# EAGLE schematic vco_pots (EAGLE 7.7.0)
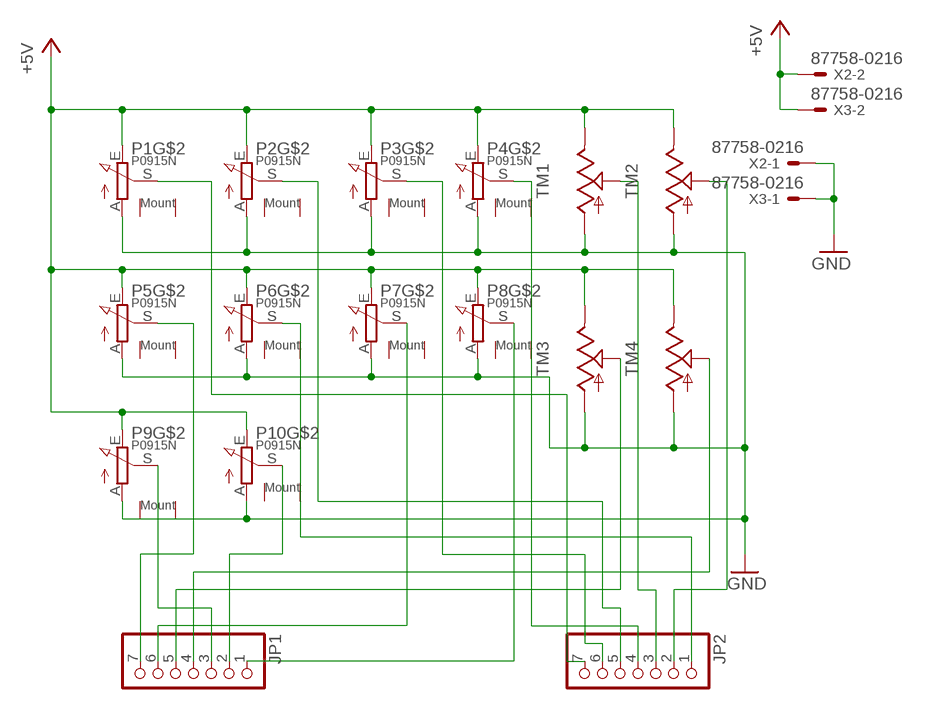
[diagram p0: schematic, sheet 1]

## Parts
JP1  PINHD-1X7  [1X07]
JP2  PINHD-1X7  [1X07]
P1  P0915N  [P0915N]
P2  P0915N  [P0915N]
P3  P0915N  [P0915N]
P4  P0915N  [P0915N]
P5  P0915N  [P0915N]
P6  P0915N  [P0915N]
P7  P0915N  [P0915N]
P8  P0915N  [P0915N]
P9  P0915N  [P0915N]
P10  P0915N  [P0915N]
TM1  TRIMSLIDE60  [SLIDEPOT-60]
TM2  TRIMSLIDE60  [SLIDEPOT-60]
TM3  TRIMSLIDE60  [SLIDEPOT-60]
TM4  TRIMSLIDE60  [SLIDEPOT-60]
X2  87758-0216  [87758-0216]
X3  87758-0216  [87758-0216]

## Nets
+5V: P1.E P2.E P3.E P4.E P5.E P6.E P7.E P8.E P9.E P10.E TM1.B TM2.B TM3.B TM4.B X2.2 X3.2
GND: P1.A P2.A P3.A P4.A P5.A P6.A P7.A P8.A P9.A P10.A TM1.A TM2.A TM3.A TM4.A X2.1 X3.1
N$1: JP1.2 P10.S
N$2: JP2.1 P6.S
N$3: JP2.5 P2.S
N$4: JP1.6 P7.S
N$5: JP2.6 P3.S
N$6: JP1.1 P8.S
N$7: JP1.3 P9.S
N$8: JP1.7 P5.S
N$9: JP2.7 P1.S
N$10: JP2.4 P4.S
N$11: JP1.4 TM4.WIPER
N$12: JP1.5 TM3.WIPER
N$13: JP2.2 TM2.WIPER
N$14: JP2.3 TM1.WIPER
Unconnected: P1.GND@1(GND) P1.GND@2(GND) P2.GND@1(GND) P2.GND@2(GND) P3.GND@1(GND) P3.GND@2(GND) P4.GND@1(GND) P4.GND@2(GND) P5.GND@1(GND) P5.GND@2(GND) P6.GND@1(GND) P6.GND@2(GND) P7.GND@1(GND) P7.GND@2(GND) P8.GND@1(GND) P8.GND@2(GND) P9.GND@1(GND) P9.GND@2(GND) P10.GND@1(GND) P10.GND@2(GND)

## Library data of the parts
JP1 JP2 = pinhead:PINHD-1X7: PIN HEADER
P1-P10 = pot-tt_electronics:P0915N
TM1-TM4 = stefan-lochbrunner_EAGLE_master_custom%20libraries_potentiometers_Bourns%20PTA%20series_Bourns%20PTA%20series:TRIM: Sliding potentiometers Based on Adafruits (https://github.com/adafruit/Adafruit-Eagle-Library) 'TRIM' device. For Bourns PTA series and TT Electronics PSxx series potentiometers.
X2 X3 = con-molex:87758-0216: 2 Pin - 2mm Dual Row Single Wafer, Vertical T/H HDR Source: http://www.molex.com/pdm_docs/sd/877580616_sd.pdf; MPN: 87758-0216; OC_FARNELL: unknown; OC_NEWARK: 94M1513